# EAGLE schematic GameboyCartridgeKS_Modest (EAGLE 6.3)
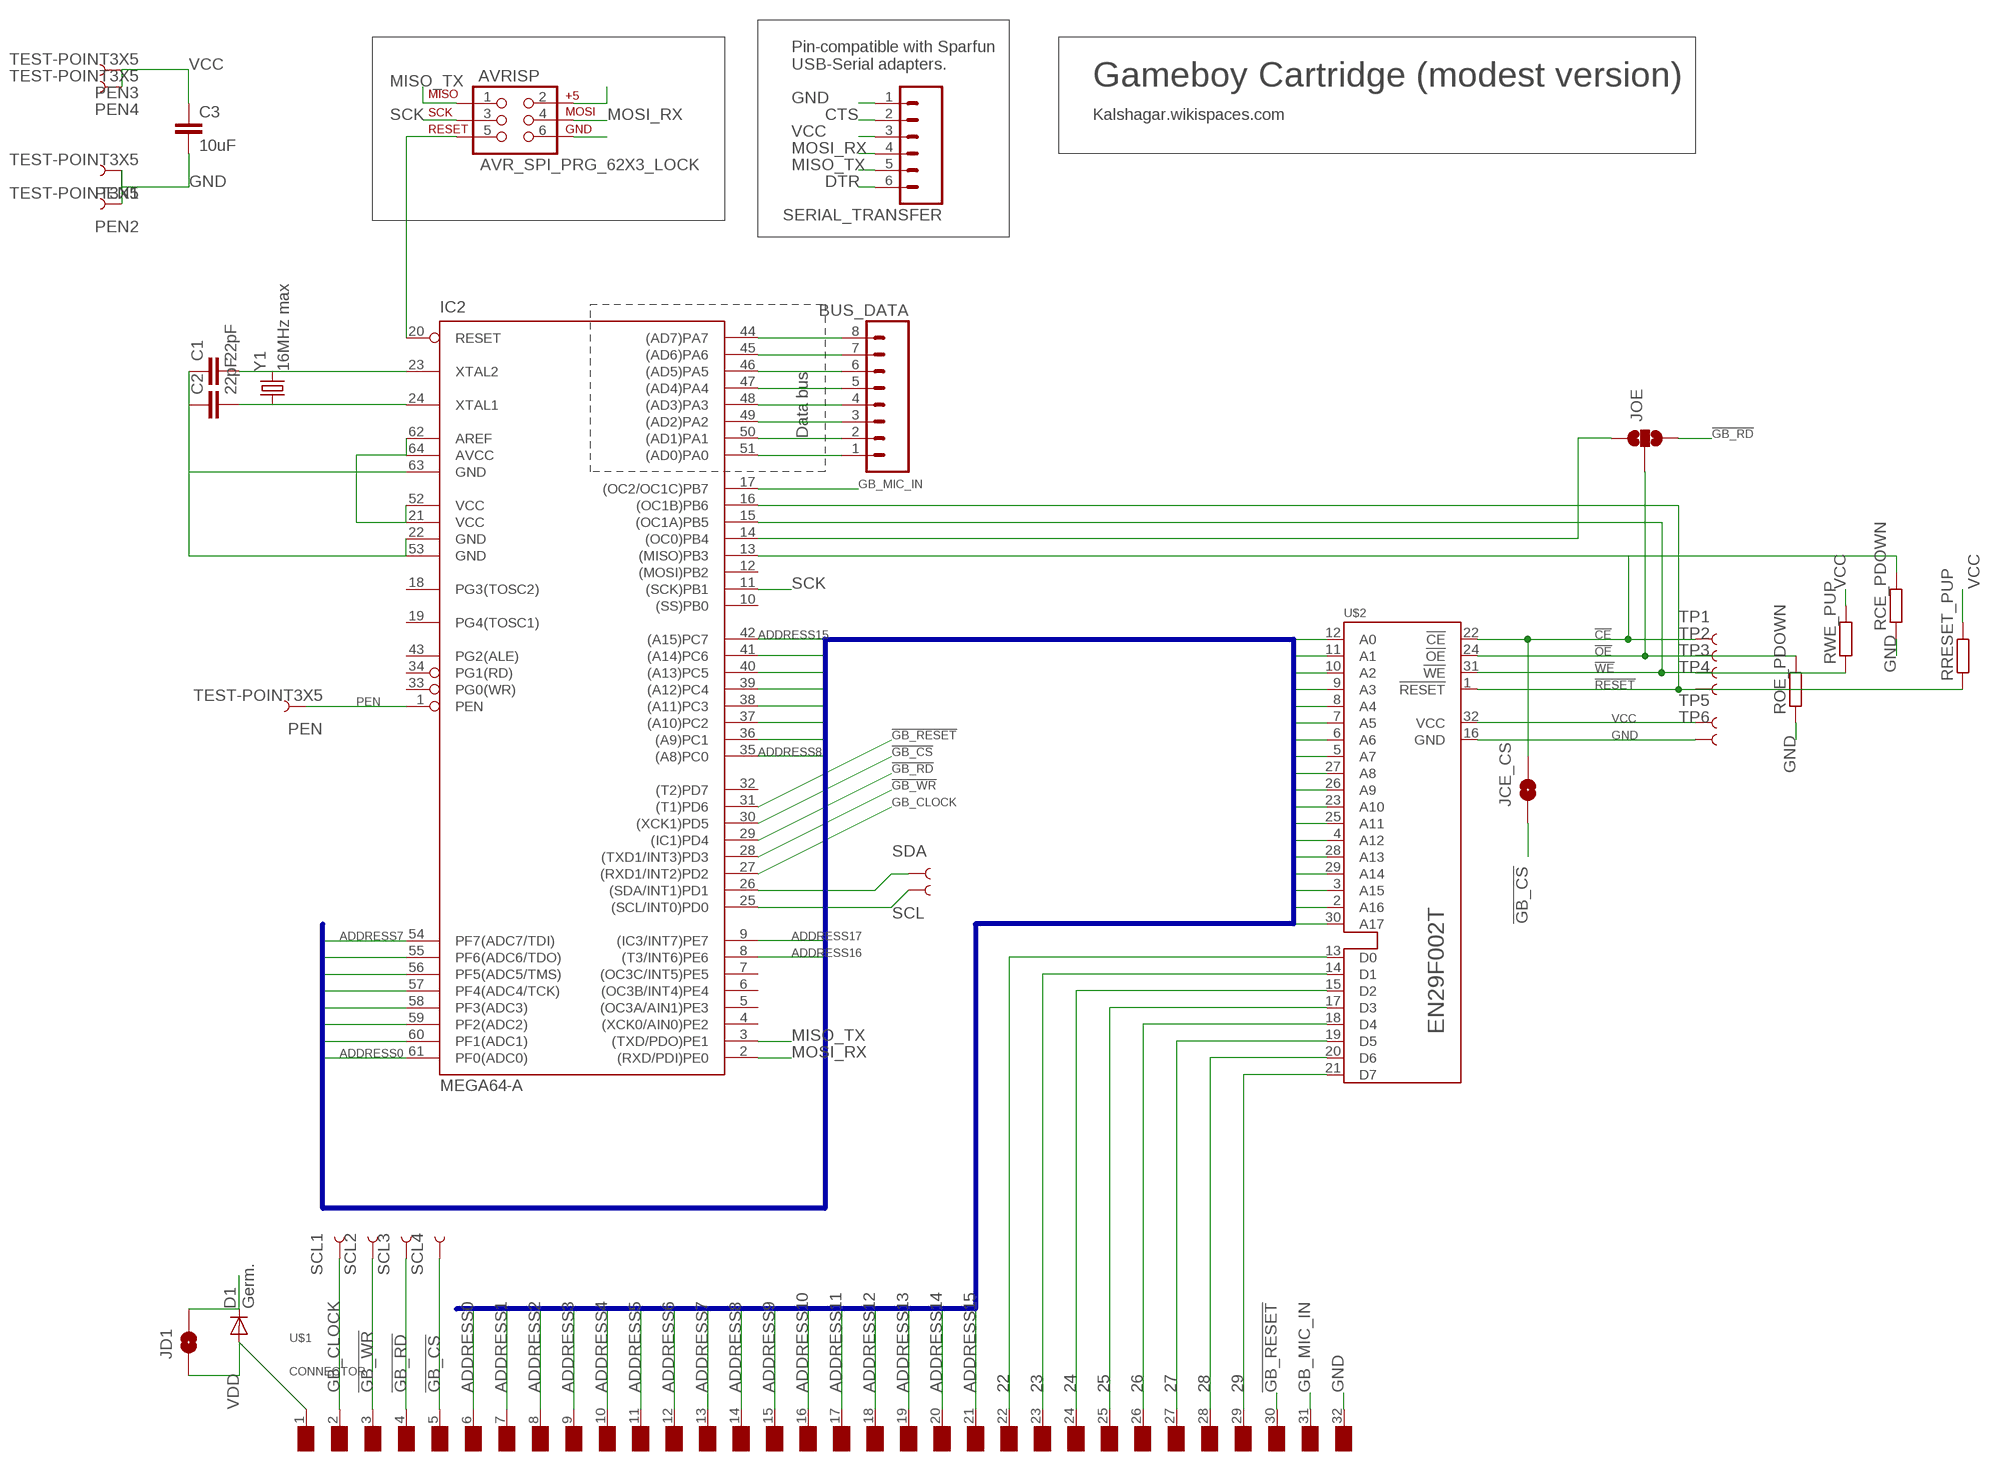
[diagram p0: schematic, sheet 1]

## Parts
AVRISP  AVR_SPI_PRG_62X3_LOCK  [2X3_LOCK]
BUS_DATA  M08NO_SILK  [1X08_PIN1_NO_SILK]
C1  22pF  C-EUC0805K  [C0805K]
C2  22pF  C-EUC0805K  [C0805K]
C3  10uF  C-EUC1206K  [C1206K]
D1  Germ.  1N4148DO35-7  [DO35-7]
IC2  MEGA64-A  [TQFP64]
JCE_CS  JUMPER-PAD-2-NO  [PAD-JUMPER-2-NO_NO_SILK]
JD1  JUMPER-PAD-2-NO  [PAD-JUMPER-2-NO_NO_SILK]
JOE  JUMPER-PAD-3-NOYES_SILK  [PAD-JUMPER-3-NO_YES_SILK]
PEN  TEST-POINT3X5  [PAD.03X.05]
PEN1  TEST-POINT3X5  [PAD.03X.05]
PEN2  TEST-POINT3X5  [PAD.03X.05]
PEN3  TEST-POINT3X5  [PAD.03X.05]
PEN4  TEST-POINT3X5  [PAD.03X.05]
RCE_PDOWN  R-EU_R1206  [R1206]
ROE_PDOWN  R-EU_R1206  [R1206]
RRESET_PUP  R-EU_R1206  [R1206]
RWE_PUP  R-EU_R1206  [R1206]
SCL  TEST-POINT3X5  [PAD.03X.05]
SCL1  TEST-POINT3X5  [PAD.03X.05]
SCL2  TEST-POINT3X5  [PAD.03X.05]
SCL3  TEST-POINT3X5  [PAD.03X.05]
SCL4  TEST-POINT3X5  [PAD.03X.05]
SDA  TEST-POINT3X5  [PAD.03X.05]
SERIAL_TRANSFER  M06SILK_FEMALE_PTH  [1X06]
TP1  TEST-POINT3X5  [PAD.03X.05]
TP2  TEST-POINT3X5  [PAD.03X.05]
TP3  TEST-POINT3X5  [PAD.03X.05]
TP4  TEST-POINT3X5  [PAD.03X.05]
TP5  TEST-POINT3X5  [PAD.03X.05]
TP6  TEST-POINT3X5  [PAD.03X.05]
U$1  CONNECTOR  [CONNECTOR]
U$2  EN29F002T  [PLCC-S32]
Y1  16MHz max  CRYSTALHC49UV  [HC49U-V]

## Nets
22: BUS_DATA.1 IC2.51((AD0)PA0) U$1.22(D0) U$2.13(D0)
23: BUS_DATA.2 IC2.50((AD1)PA1) U$1.23(D1) U$2.14(D1)
24: BUS_DATA.3 IC2.49((AD2)PA2) U$1.24(D2) U$2.15(D2)
25: BUS_DATA.4 IC2.48((AD3)PA3) U$1.25(D3) U$2.17(D3)
26: BUS_DATA.5 IC2.47((AD4)PA4) U$1.26(D4) U$2.18(D4)
27: BUS_DATA.6 IC2.46((AD5)PA5) U$1.27(D5) U$2.19(D5)
28: BUS_DATA.7 IC2.45((AD6)PA6) U$1.28(D6) U$2.20(D6)
29: BUS_DATA.8 IC2.44((AD7)PA7) U$1.29(D7) U$2.21(D7)
!CE: IC2.13((MISO)PB3) JCE_CS.2 RCE_PDOWN.2 TP1.P$1 U$2.22(!CE)
!GB_CS: IC2.30((XCK1)PD5) JCE_CS.1 SCL4.P$1 U$1.5(/RCS)
!GB_RD: IC2.29((IC1)PD4) JOE.3 SCL3.P$1 U$1.4(/RD)
!GB_RESET: IC2.31((T1)PD6) U$1.30(/RS)
!GB_WR: IC2.28((TXD1/INT3)PD3) SCL2.P$1 U$1.3(/WR)
!OE: JOE.2 ROE_PDOWN.2 TP2.P$1 U$2.24(!OE)
!RESET: IC2.16((OC1B)PB6) RRESET_PUP.1 TP4.P$1 U$2.1(!RESET)
!WE: IC2.15((OC1A)PB5) RWE_PUP.1 TP3.P$1 U$2.31(!WE)
ADDRESS0: IC2.61(PF0(ADC0)) U$1.6(A0) U$2.12(A0)
ADDRESS1: IC2.60(PF1(ADC1)) U$1.7(A1) U$2.11(A1)
ADDRESS2: IC2.59(PF2(ADC2)) U$1.8(A2) U$2.10(A2)
ADDRESS3: IC2.58(PF3(ADC3)) U$1.9(A3) U$2.9(A3)
ADDRESS4: IC2.57(PF4(ADC4/TCK)) U$1.10(A4) U$2.8(A4)
ADDRESS5: IC2.56(PF5(ADC5/TMS)) U$1.11(A5) U$2.7(A5)
ADDRESS6: IC2.55(PF6(ADC6/TDO)) U$1.12(A6) U$2.6(A6)
ADDRESS7: IC2.54(PF7(ADC7/TDI)) U$1.13(A7) U$2.5(A7)
ADDRESS8: IC2.35((A8)PC0) U$1.14(A8) U$2.27(A8)
ADDRESS9: IC2.36((A9)PC1) U$1.15(A9) U$2.26(A9)
ADDRESS10: IC2.37((A10)PC2) U$1.16(A10) U$2.23(A10)
ADDRESS11: IC2.38((A11)PC3) U$1.17(A11) U$2.25(A11)
ADDRESS12: IC2.39((A12)PC4) U$1.18(A12) U$2.4(A12)
ADDRESS13: IC2.40((A13)PC5) U$1.19(A13) U$2.28(A13)
ADDRESS14: IC2.41((A14)PC6) U$1.20(A14) U$2.29(A14)
ADDRESS15: IC2.42((A15)PC7) U$1.21(A15) U$2.3(A15)
ADDRESS16: IC2.8((T3/INT6)PE6) U$2.2(A16)
ADDRESS17: IC2.9((IC3/INT7)PE7) U$2.30(A17)
CTS: SERIAL_TRANSFER.2
DTR: SERIAL_TRANSFER.6
GB_CLOCK: IC2.27((RXD1/INT2)PD2) SCL1.P$1 U$1.2(NC)
GB_MIC_IN: IC2.17((OC2/OC1C)PB7) U$1.31(VIN)
GND: AVRISP.6 C1.1 C2.1 C3.2 IC2.22(GND) IC2.53(GND) IC2.63(GND) PEN1.P$1 PEN2.P$1 RCE_PDOWN.1 ROE_PDOWN.1 SERIAL_TRANSFER.1 TP6.P$1 U$1.32(GND) U$2.16(GND)
MISO_TX: AVRISP.1 IC2.3((TXD/PDO)PE1) SERIAL_TRANSFER.5
MOSI_RX: AVRISP.4 IC2.2((RXD/PDI)PE0) SERIAL_TRANSFER.4
N$2: C1.2 IC2.23(XTAL2) Y1.2
N$3: AVRISP.5 IC2.20(RESET)
N$4: C2.2 IC2.24(XTAL1) Y1.1
N$7: IC2.14((OC0)PB4) JOE.1
PEN: IC2.1(PEN) PEN.P$1
SCK: AVRISP.3 IC2.11((SCK)PB1)
SCL: IC2.25((SCL/INT0)PD0) SCL.P$1
SDA: IC2.26((SDA/INT1)PD1) SDA.P$1
VCC: AVRISP.2 C3.1 D1.C IC2.21(VCC) IC2.52(VCC) IC2.62(AREF) IC2.64(AVCC) JD1.2 PEN3.P$1 PEN4.P$1 RRESET_PUP.2 RWE_PUP.2 SERIAL_TRANSFER.3 TP5.P$1 U$2.32(VCC)
VDD: D1.A JD1.1 U$1.1(VDD)
Unconnected: IC2.4((XCK0/AIN0)PE2) IC2.5((OC3A/AIN1)PE3) IC2.6((OC3B/INT4)PE4) IC2.7((OC3C/INT5)PE5) IC2.10((SS)PB0) IC2.12((MOSI)PB2) IC2.18(PG3(TOSC2)) IC2.19(PG4(TOSC1)) IC2.32((T2)PD7) IC2.33(PG0(WR)) IC2.34(PG1(RD)) IC2.43(PG2(ALE))

## Buses
ADDRESS[0..17]

## Notes on the sheet
- Pin-compatible with Sparfun 
  USB-Serial adapters.
- Gameboy Cartridge (modest version)
- Kalshagar.wikispaces.com
- Data bus

## Library data of the parts
AVRISP = SparkFun-Connectors:AVR_SPI_PRG_6: AVR ISP 6 Pin This is the reduced ISP connector for AVR programming. Common on Arduino. This footprint will take up less PCB space and can be used with a 10-pin to 6-pin adapter such as SKU: BOB-08508 **Special note about "TEST_POINT" package. The stop mask is on the top side, so if you want your programming test points to be on the bottom of your board, make sure to place this package on the bottom side of the board. This also ensure that the orientation to program from the bottom side will be correct.
BUS_DATA = SparkFun-Connectors:M08: Header 8 Standard 8-pin 0.1" header. Use with straight break away headers (SKU : PRT-00116), right angle break away headers (PRT-00553), swiss pins (PRT-00743), machine pins (PRT-00117), and female headers (PRT-00115).
C1-C3 = resistor:C-EU: CAPACITOR, European symbol
D1 = diode:1N4148: DIODE high speed (Philips)
IC2 = atmel:MEGA64: MICROCONTROLLER 64 Kbytes FLASH 4 Kbytes SRAM 2 Kbytes EEPROM DUAL USART 8-channel 10 bit ADC Source: avr.lbr; MPN: ATMEGA64-16AU; OC_FARNELL: 9171355; OC_NEWARK: 01M6899
JCE_CS JD1 = SparkFun-Passives:JUMPER-PAD-2-NO
JOE = SparkFun-Passives:JUMPER-PAD-3-NO
PEN PEN1-PEN4 SCL SCL1-SCL4 SDA TP1-TP6 = SparkFun-Passives:TEST-POINT: Bare copper test points for troubleshooting or ICT
RCE_PDOWN ROE_PDOWN RRESET_PUP RWE_PUP = resistor:R-EU_: RESISTOR, European symbol
SERIAL_TRANSFER = SparkFun-Connectors:M06: Header 6 Standard 6-pin 0.1" header. Use with straight break away headers (SKU : PRT-00116), right angle break away headers (PRT-00553), swiss pins (PRT-00743), machine pins (PRT-00117), and female headers (PRT-00115). Molex polarized connector foot print use with SKU : PRT-08094 with associated crimp pins and housings. NOTES ON THE VARIANTS LOCK and LOCK_LONGPADS... This footprint was designed to help hold the alignment of a through-hole component (i.e. 6-pin header) while soldering it into place. You may notice that each hole has been shifted either up or down by 0.005 of an inch from it's more standard position (which is a perfectly straight line). This slight alteration caused the pins (the squares in the middle) to touch the edges of the holes. Because they are alternating, it causes a "brace" to hold the component in place. 0.005 has proven to be the perfect amount of "off-center" position when using our standard breakaway headers. Although looks a little odd when you look at the bare footprint, once you have a header in there, the alteration is very hard to notice. Also,if you push a header all the way into place, it is covered up entirely on the bottom side. This idea of altering the position of holes to aid alignment will be further integrated into the Sparkfun Library for other footprints. It can help hold any component with 3 or more connection pins.; PROD_ID: CONN-08437
U$1 = gameboy:CONNECTOR: Connector Pads for Gameboy Cartridges
U$2 = kalshagar:EN29F002T: 2 MB flash memory in PLCC-S32 package.
Y1 = SparkFun-FreqCtrl:CRYSTAL: Various standard crystals. Proven footprints.